# Altium schematic sheet Motor Driver.SchDoc
size A4; SheetNumber: 1; SheetTotal: 1
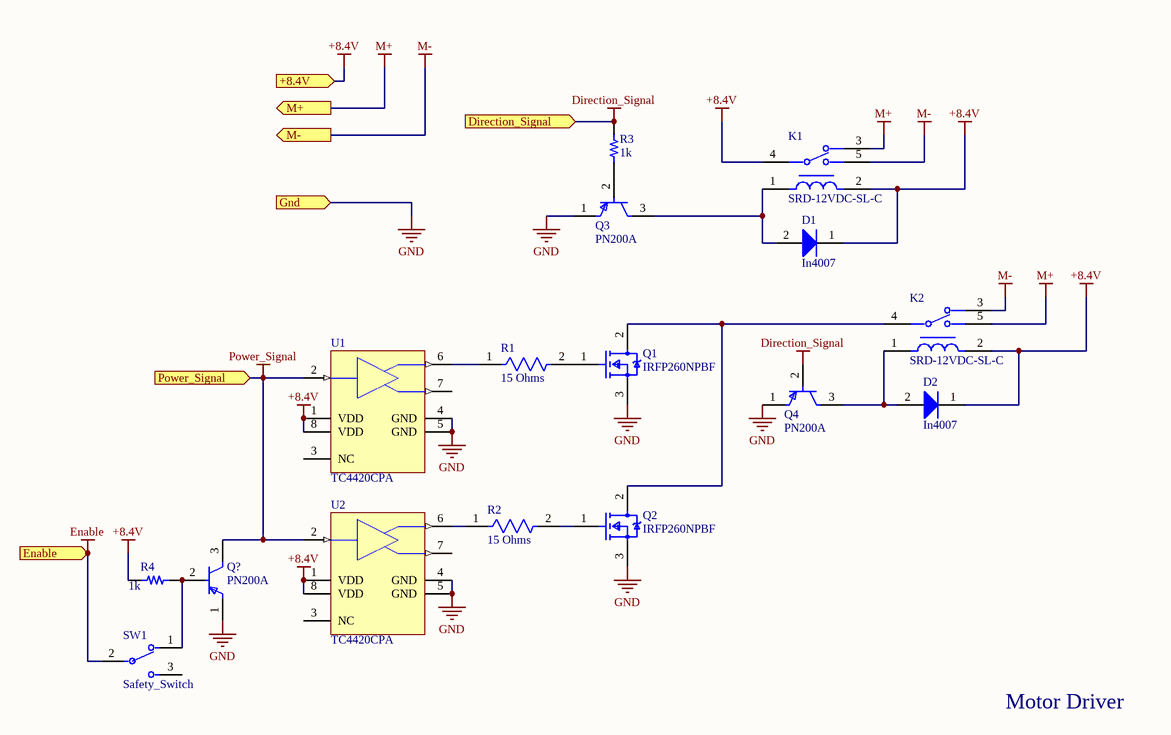
[diagram p0: Motor Driver.SchDoc]

## Parts
D1  In4007  [ONSC-SOD-323-2-477-02_V]
D2  In4007  [ONSC-SOD-323-2-477-02_V]
K1  SRD-12VDC-SL-C  [FP-1393280-6-MFG]
K2  SRD-12VDC-SL-C  [FP-1393280-6-MFG]
Q1  IRFP260NPBF  [FP-PG-TO247-3-MFG]
Q2  IRFP260NPBF  [FP-PG-TO247-3-MFG]
Q3  PN200A  [FP-135AN-MFG]
Q4  PN200A  [FP-135AN-MFG]
Q?  PN200A  [FP-135AN-MFG]
R1  15 Ohms  [FP-RLR07-MFG]
R2  15 Ohms  [FP-RLR07-MFG]
R3  Resistance: 1k  [ONB RES 1K OHM 1% 1_10W 0603-Footprint-1]
R4  Resistance: 1k  [ONB RES 1K OHM 1% 1_10W 0603-Footprint-1]
SW1  Safety_Switch  [FP-A101SYCB04-MFG]
U1  TC4420CPA  [PDIP300-PA8]
U2  TC4420CPA  [PDIP300-PA8]

## Ports
+8.4V (in), Direction_Signal (in), Enable (in), Gnd (in), M+ (out), M- (out), Power_Signal (in)

## Nets
+8.4V: D1.1(K) D2.1(K) K1.2 K1.4 K2.2 R4.1 U1.1(VDD) U1.8(VDD) U2.1(VDD) U2.8(VDD) ; port +8.4V
Direction_Signal: Q4.2(B) R3.2 ; port Direction_Signal
Enable: SW1.2 ; port Enable
GND: Q1.3(S) Q2.3(S) Q3.1(E) Q4.1(E) Q?.1(E) U1.4(GND) U1.5(GND) U2.4(GND) U2.5(GND) ; port Gnd
M+: K1.3 K2.5 ; port M+
M-: K1.5 K2.3 ; port M-
Power_Signal: Q?.3(C) U1.2(IN) U2.2(IN) ; port Power_Signal
NetD1_2: D1.2(A) K1.1 Q3.3(C)
NetD2_2: D2.2(A) K2.1 Q4.3(C)
NetK2_4: K2.4 Q1.2(D) Q2.2(D)
NetQ1_1: Q1.1(G) R1.2
NetQ2_1: Q2.1(G) R2.2
NetQ3_2: Q3.2(B) R3.1
NetQ?_2: Q?.2(B) R4.2 SW1.1
NetR1_1: R1.1 U1.6(OUT)
NetR2_1: R2.1 U2.6(OUT)

Not connected (* = marked no-connect by the designer): SW1 3; U1 3(NC) 7(OUT); U2 3(NC) 7(OUT)

## Notes on the sheet
- Motor Driver

## Library data of the parts
D1 D2 = CMP-1055-00462-1: Schottky Barrier Diode, 2-Pin SOD-323, Pb-Free, Tape and Reel; PartNumber: BAT54HT1G; Manufacturer: On Semiconductor; Configuration: Single; trr Max (ns): 5; IFSM Max (A): 0.6; ComponentLink3URL: http://www.onsemi.com/pub_link/Collateral/477-02.PDF.1; PackageDescription: 2-Pin SOD, Body 1.7 x 1.25 mm; ComponentLink2URL: http://www.onsemi.cn/pub_link/Collateral/BAT54HT1-D.PDF; ComponentLink3Description: Package Specification; ComponentLink2Description: Datasheet; DatasheetVersion: Rev. 6; PackageReference: SOD-323-2-477-02; RoHS: TRUE; ComponentLink1URL: http://www.onsemi.com/; Packing: Tape and Reel; Mounting Technology: Surface Mount; ComponentLink1Description: Manufacturer URL; PackageVersion: Rev. H, 03/2007
K1 K2 = CMP-03395-000123-1: Electromechanical Relay 12VDC 254Ohm 40A SPDT (12.9x12x9.9)mm THT Power Relay; Manufacturer Part Number: 1393280-6; Manufacturer: TE Connectivity; Coil Voltage: 12V; Number Of Contacts: 1; Coil Resistance: 254Ω; Coil Type: Non-Latching; Standoff Height: 0.3mm; Current Rating: 30A; Coil Power: 567mW; Ambient Temperature Range Low: -40°C; Device Class L2: Relays; ComponentLink2URL: https://www.te.com/commerce/DocumentDelivery/DDEController?Action=showdoc&DocId=Data+Sheet%7FV23086-X0000-A001%7F0717%7Fpdf%7FEnglish%7FENG_DS_V23086-X0000-A001_0717.pdf%7F1393280-6; Device Class L1: Electromechanical; ComponentLink2Description: Datasheet; Lead Free: Yes; Package: 1393280-6; Device Class L3: Power Relays; RoHS: TRUE; Footprint Url: https://www.te.com/commerce/DocumentDelivery/DDEController?Action=showdoc&DocId=Customer+Drawing%7FV23086-C1001-A403%7FE%7Fpdf%7FEnglish%7FENG_CD_V23086-C1001-A403_E.pdf%7F1393280-6; Octopart: https://octopart.com/1393280-6-te+connectivity-45289632; Automotive: No; Category: Relay; Throw Configuration: SPDT; Ambient Temperature Range High: +105°C; Height: 10.1mm
Q1 Q2 = CMP-32901-000262-1: MOSFET N-CH 200V 50A TO247AC; Drain to Source Resistance: 40mR; Turn-On Delay Time: 17ns; Gate to Source Voltage (Vgs): 20V; Turn-Off Delay Time: 55ns; Max Power Dissipation: 300W; Element Configuration: Single; Input Capacitance: 4.057nF; Threshold Voltage: 4V; Width: 0.209inch; Max Operating Temperature: 175°C; Number of Pins: 3; Lead Free: Lead Free; Rds On Max: 40mR; Case/Package: TO-247; Continuous Drain Current (ID): 50A; Power Dissipation: 300W; RoHS Compliant: Yes; Min Operating Temperature: -55°C; Drain to Source Voltage (Vdss): 200V; Mount: Through Hole; REACH SVHC: No SVHC; Packaging: Bulk; Drain to Source Breakdown Voltage: 200V; Halogen Free: Not Halogen Free; Height: 0.799inch; Length: 0.625inch; Max Dual Supply Voltage: 200V
Q3 Q4 Q? = CMP-00278-84331081-1: PN200A Bipolar Transistors - BJT PNP Transistor General Purpose; Manufacturer Lifecycle Status: OBSOLETE; Transition Frequency: 250MHz; Number of Elements: 1; Max Power Dissipation: 625mW; Max Junction Temperature (Tj): 150°C; Collector Emitter Breakdown Voltage: -45V; Collector Base Voltage (VCBO): -60V; Max Collector Current: -500mA; hFE Min: 300; Emitter Base Voltage (VEBO): -6V; Element Configuration: Single; Collector Emitter Saturation Voltage: -400mV; Mount: Through Hole; Number of Pins: 3; Width: 4.19mm; Length: 5.2mm; Height: 5.33mm; Max Operating Temperature: 150°C; Packaging: Bulk; Radiation Hardening: No; Power Dissipation: 625mW; Polarity: PNP; Lifecycle Status: Obsolete; Schedule B: 8541210080, 8541210080; Collector Emitter Voltage (VCEO): -45V; Case/Package: TO-92; Current Rating: -500mA; Frequency: 250MHz; Min Operating Temperature: -55°C; Gain Bandwidth Product: 250MHz; Voltage Rating (DC): -45V; Lead Free: Lead Free; Max Frequency: 250MHz; RoHS: Compliant; Weight: 201mg
R1 R2 = CMP-00030-42769933-1: RLR07C15R0FSB14 Res Metal Film 15 Ohm 1% 1/4W ±100ppm/°C 0.001% Conformal AXL Thru-Hole Bulk; Power Rating: 250mW; Resistance: 15Ω; Failure Rate: 0.001%; Contact Plating: Lead, Tin; Case/Package: Conformal; Width: 2.29mm; Min Operating Temperature: -65°C; Number of Terminations: 2; Features: Military, Moisture Resistant, Weldable; Military Standard: MIL-PRF-39017; Length: 7.62mm; NexarPartId: 42769933; Temperature Coefficient: 100ppm/°C; Mount: Through Hole; Tolerance: 1%; Diameter: 2.29mm; Max Operating Temperature: 150°C; Packaging: Bulk; Schedule B: 8533210090; Max Power Dissipation: 250mW; Lead Free: Contains Lead; Termination: Axial; RoHS: Compliant; Composition: Metal Film
R3 R4 = CMP-00079-1: Fixed Resistor, Metal Glaze/thick Film, 0.1W, 1000ohm, 75V, 1% +/-Tol, 100ppm/Cel, Surface Mount, 0603; Temperature Coefficient: 100ppm/°C; Voltage Rating: 75V; Case/Package: 0603
SW1 = CMP-03408-000017-1: SWITCH TOGGLE SPDT 0.4VA 20V; Electrical Life: 6000Cycles; Number of Poles: 1; Power Rating: 400mW; Switch Function: On-On; Contact Resistance: 10mR; Contact Current Rating: 400mA; Actuator Material: Phenolic; Insulation Resistance: 30MR; Actuator Color: Chrome; Number of Positions: 2; Actuator Type: Standard Round; Actuator Length: 10.41mm; Illumination Type: Non-Illuminated; Flammability Rating: UL94 V-1; Contact Material: Copper; Depth: 6.86mm; Contact Plating: Gold; Voltage Rating (AC): 20V; Max Voltage Rating (DC): 20V; Min Operating Temperature: -30°C; Max Operating Temperature: 85°C; Throw Configuration: SPDT; Packaging: Bulk; Termination: PC Pins; Series: Gemini A; ELV: Compliant; Lead Free: Lead Free; RoHS Compliant: Yes; REACH SVHC: No SVHC; Mount: Panel; Orientation: Straight; Package Quantity: 100; Max Voltage Rating (AC): 20V; Radiation Hardening: No; Voltage Rating (DC): 20V
U1 U2 = CMP-0137-00001-1: 6A High-Speed MOSFET Driver, Non-Inverting, Commercial Temperature; Code_JEDEC: MS-001-BA; PackageReference: PDIP300-PA8; PackageVersion: revBB, Aug-2009; PackageDescription: 8-Lead Plastic Dual In-Line (PA) - 300 mil Body [PDIP]; DatasheetVersion: revC, Aug-2004